# Altium project AnalExtend.PrjPcb
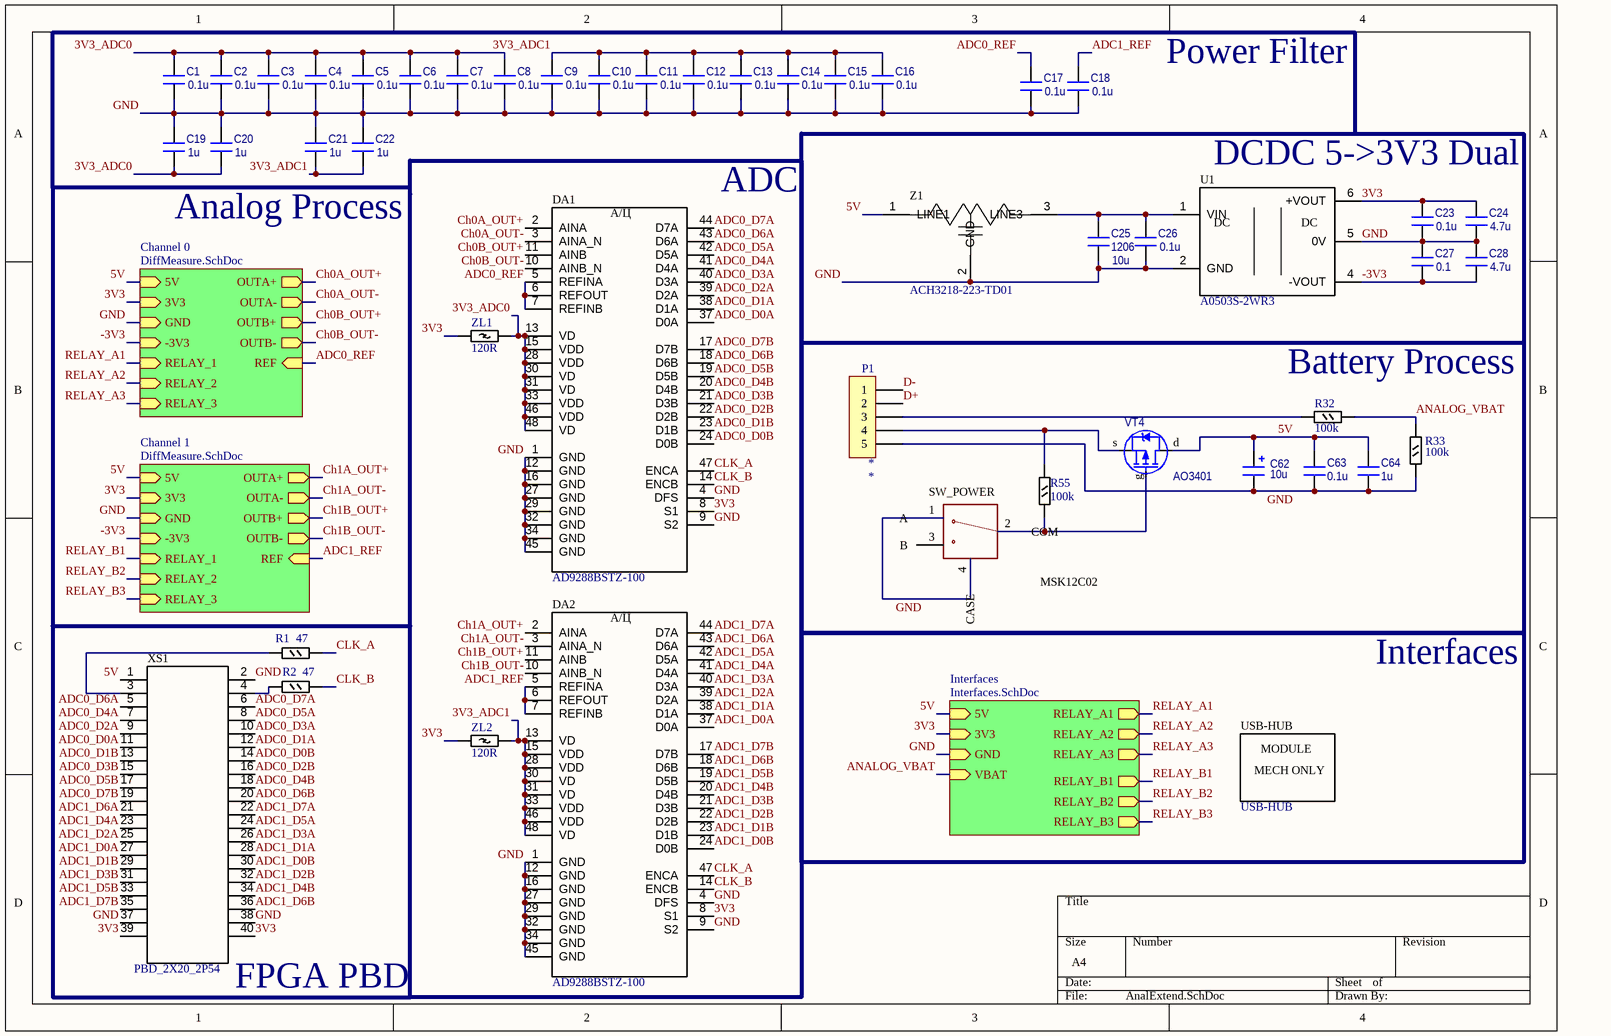
[diagram p0: AnalExtend.SchDoc]
3 sheets, 277 parts. Net scope: hierarchical (ports join the sheet entries above them; power ports are global).
Board file: AnalExtend.PcbDoc
Sheets:
  AnalExtend.SchDoc
    Channel 0 = DiffMeasure.SchDoc
    Channel 1 = DiffMeasure.SchDoc
    Interfaces = Interfaces.SchDoc

## Sheet AnalExtend.SchDoc
size A4

### Parts
C1  value 0.1u  [CAPC2012(0805)N]
C2  value 0.1u  [CAPC2012(0805)N]
C3  value 0.1u  [CAPC2012(0805)N]
C4  value 0.1u  [CAPC2012(0805)N]
C5  value 0.1u  [CAPC2012(0805)N]
C6  value 0.1u  [CAPC2012(0805)N]
C7  value 0.1u  [CAPC2012(0805)N]
C8  value 0.1u  [CAPC2012(0805)N]
C9  value 0.1u  [CAPC2012(0805)N]
C10  value 0.1u  [CAPC2012(0805)N]
C11  value 0.1u  [CAPC2012(0805)N]
C12  value 0.1u  [CAPC2012(0805)N]
C13  value 0.1u  [CAPC2012(0805)N]
C14  value 0.1u  [CAPC2012(0805)N]
C15  value 0.1u  [CAPC2012(0805)N]
C16  value 0.1u  [CAPC2012(0805)N]
C17  value 0.1u  [CAPC2012(0805)N]
C18  value 0.1u  [CAPC2012(0805)N]
C19  value 1u  [CAPC2012(0805)N]
C20  value 1u  [CAPC2012(0805)N]
C21  value 1u  [CAPC2012(0805)N]
C22  value 1u  [CAPC2012(0805)N]
C23  value 0.1u  [CAPC2012(0805)N]
C24  value 4.7u  [CAPC2012(0805)N]
C25  value 10u  Package: 1206  [CAP_CER_1206]  (hidden comment: 2700p 50V)
C26  value 0.1u  [CAPC2012(0805)N]
C27  value 0.1  [CAPC2012(0805)N]
C28  value 4.7u  [CAPC2012(0805)N]
C62  10u  [CAPMP3528X210N]
C63  0.1u  [CAPC2012(0805)N]
C64  1u  [CAPC2012(0805)N]
DA1  AD9288BSTZ-100  [AD9288BSTZ-100_LQFP48]
DA2  AD9288BSTZ-100  [AD9288BSTZ-100_LQFP48]
P1  P_HEADER_1x5  [P_HEADER_1x5_2.54_ANGLE]  (value not drawn)
R1  47  [RESC2012(0805)N]
R2  47  [RESC2012(0805)N]
R32  100k  [RESC2012(0805)N]
R33  100k  [RESC2012(0805)N]
R55  100k  [RESC2012(0805)N]
SW_POWER  MSK12C02  [MSK12C02]
U1  A0503S-2WR3  [A0503S-2WR3_SIP5]
USB-HUB  USB-HUB  [MINGWU_29P3X18P9_MECH]
VT4  AO3401  [SOT23-3N]
XS1  PBD_2X20_2P54  [PBD_2X20_2P54_THT]
Z1  ACH3218-223-TD01  [ACH3218_3TERM_FILTER]
ZL1  120R  [INDC1608(0603)N]
ZL2  120R  [INDC1608(0603)N]

### Blocks framed on the sheet
ADC: DA1 DA2 ZL1 ZL2

### Sub-sheets
Channel 0 = DiffMeasure.SchDoc: 3V3 (in), GND (in), REF (in), -3V3 (in), 5V (in), OUTA- (out), OUTB+ (out), OUTA+ (out), OUTB- (out), RELAY_1 (in), RELAY_2 (in), RELAY_3 (in)
Channel 1 = DiffMeasure.SchDoc: 3V3 (in), GND (in), REF (in), -3V3 (in), 5V (in), OUTA- (out), OUTB+ (out), OUTB- (out), OUTA+ (out), RELAY_2 (in), RELAY_3 (in), RELAY_1 (in)
Interfaces = Interfaces.SchDoc: 5V (in), 3V3 (in), GND (in), VBAT (in), RELAY_B3 (out), RELAY_B2 (out), RELAY_B1 (out), RELAY_A3 (out), RELAY_A2 (out), RELAY_A1 (out)

### Nets
3V3: C23.1 C24.1 DA1.8(S1) DA2.8(S1) U1.6(+VOUT) XS1.39 XS1.40 ZL1.1 ZL2.1 ; sheet Channel 0/3V3, sheet Channel 1/3V3, sheet Interfaces/3V3
3V3_ADC0: C1.1 C2.1 C3.1 C4.1 C5.1 C6.1 C7.1 C8.1 C19.2 C20.2 DA1.13(VD) DA1.15(VDD) DA1.28(VDD) DA1.30(VD) DA1.31(VD) DA1.33(VDD) DA1.46(VDD) DA1.48(VD) ZL1.2
3V3_ADC1: C9.1 C10.1 C11.1 C12.1 C13.1 C14.1 C15.1 C16.1 C21.2 C22.2 DA2.13(VD) DA2.15(VDD) DA2.28(VDD) DA2.30(VD) DA2.31(VD) DA2.33(VDD) DA2.46(VDD) DA2.48(VD) ZL2.2
5V: C62.1 C63.1 C64.1 VT4.d XS1.1 Z1.1(LINE1) ; sheet Channel 0/5V, sheet Channel 1/5V, sheet Interfaces/5V
-3V3: C27.2 C28.2 U1.4(-VOUT) ; sheet Channel 0/-3V3, sheet Channel 1/-3V3
ADC0_D0A: DA1.37(D0A) XS1.11
ADC0_D0B: DA1.24(D0B) XS1.14
ADC0_D1A: DA1.38(D1A) XS1.12
ADC0_D1B: DA1.23(D1B) XS1.13
ADC0_D2A: DA1.39(D2A) XS1.9
ADC0_D2B: DA1.22(D2B) XS1.16
ADC0_D3A: DA1.40(D3A) XS1.10
ADC0_D3B: DA1.21(D3B) XS1.15
ADC0_D4A: DA1.41(D4A) XS1.7
ADC0_D4B: DA1.20(D4B) XS1.18
ADC0_D5A: DA1.42(D5A) XS1.8
ADC0_D5B: DA1.19(D5B) XS1.17
ADC0_D6A: DA1.43(D6A) XS1.5
ADC0_D6B: DA1.18(D6B) XS1.20
ADC0_D7A: DA1.44(D7A) XS1.6
ADC0_D7B: DA1.17(D7B) XS1.19
ADC0_REF: C17.1 DA1.5(REFINA) DA1.6(REFOUT) DA1.7(REFINB) ; sheet Channel 0/REF
ADC1_D0A: DA2.37(D0A) XS1.27
ADC1_D0B: DA2.24(D0B) XS1.30
ADC1_D1A: DA2.38(D1A) XS1.28
ADC1_D1B: DA2.23(D1B) XS1.29
ADC1_D2A: DA2.39(D2A) XS1.25
ADC1_D2B: DA2.22(D2B) XS1.32
ADC1_D3A: DA2.40(D3A) XS1.26
ADC1_D3B: DA2.21(D3B) XS1.31
ADC1_D4A: DA2.41(D4A) XS1.23
ADC1_D4B: DA2.20(D4B) XS1.34
ADC1_D5A: DA2.42(D5A) XS1.24
ADC1_D5B: DA2.19(D5B) XS1.33
ADC1_D6A: DA2.43(D6A) XS1.21
ADC1_D6B: DA2.18(D6B) XS1.36
ADC1_D7A: DA2.44(D7A) XS1.22
ADC1_D7B: DA2.17(D7B) XS1.35
ADC1_REF: C18.1 DA2.5(REFINA) DA2.6(REFOUT) DA2.7(REFINB) ; sheet Channel 1/REF
ANALOG_VBAT: R32.2 R33.1 ; sheet Interfaces/VBAT
Ch0A_OUT+: DA1.2(AINA) ; sheet Channel 0/OUTA+
Ch0A_OUT-: DA1.3(AINA_N) ; sheet Channel 0/OUTA-
Ch0B_OUT+: DA1.11(AINB) ; sheet Channel 0/OUTB+
Ch0B_OUT-: DA1.10(AINB_N) ; sheet Channel 0/OUTB-
Ch1A_OUT+: DA2.2(AINA) ; sheet Channel 1/OUTA+
Ch1A_OUT-: DA2.3(AINA_N) ; sheet Channel 1/OUTA-
Ch1B_OUT+: DA2.11(AINB) ; sheet Channel 1/OUTB+
Ch1B_OUT-: DA2.10(AINB_N) ; sheet Channel 1/OUTB-
CLK_A: DA1.47(ENCA) DA2.47(ENCA) R1.2
CLK_B: DA1.14(ENCB) DA2.14(ENCB) R2.2
D+: P1.2
D-: P1.1
GND: C1.2 C2.2 C3.2 C4.2 C5.2 C6.2 C7.2 C8.2 C9.2 C10.2 C11.2 C12.2 C13.2 C14.2 C15.2 C16.2 C17.2 C18.2 C19.1 C20.1 C21.1 C22.1 C23.2 C24.2 C25.2 C26.2 C27.1 C28.1 C62.2 C63.2 C64.2 DA1.1(GND) DA1.4(DFS) DA1.9(S2) DA1.12(GND) DA1.16(GND) DA1.27(GND) DA1.29(GND) DA1.32(GND) DA1.34(GND) DA1.45(GND) DA2.1(GND) DA2.4(DFS) DA2.9(S2) DA2.12(GND) DA2.16(GND) DA2.27(GND) DA2.29(GND) DA2.32(GND) DA2.34(GND) DA2.45(GND) P1.5 R33.2 SW_POWER.1(A) SW_POWER.4(CASE) U1.2(GND) U1.5(0V) XS1.2 XS1.37 XS1.38 Z1.2(GND) ; sheet Channel 0/GND, sheet Channel 1/GND, sheet Interfaces/GND
RELAY_A1: sheet Channel 0/RELAY_1, sheet Interfaces/RELAY_A1
RELAY_A2: sheet Channel 0/RELAY_2, sheet Interfaces/RELAY_A2
RELAY_A3: sheet Channel 0/RELAY_3, sheet Interfaces/RELAY_A3
RELAY_B1: sheet Channel 1/RELAY_1, sheet Interfaces/RELAY_B1
RELAY_B2: sheet Channel 1/RELAY_2, sheet Interfaces/RELAY_B2
RELAY_B3: sheet Channel 1/RELAY_3, sheet Interfaces/RELAY_B3
NetC25_1: C25.1 C26.1 U1.1(VIN) Z1.3(LINE3)
NetP1_3: P1.3 R32.1
NetP1_4: P1.4 R55.2 VT4.s
NetR1_1: R1.1 XS1.3
NetR2_1: R2.1 XS1.4
NetR55_1: R55.1 SW_POWER.2(COM) VT4.g

Not connected (* = marked no-connect by the designer): SW_POWER 3(B)

### Notes on the sheet
- Power Filter
- DCDC 5->3V3 Dual
- Analog Process
- Battery Process
- Interfaces
- (near XS1) FPGA PBD
- (in symbol A0503S-2WR3) DC
- (in symbol AD9288BSTZ-100) А/Ц
- (in symbol MINGWU_29P3X18P9_MECH) MODULE; MECH ONLY

### Library data of the parts
C1-C24 C26-C28 C63 C64 = CAPC2012(0805): Voltage: *; Part Number: CAPC2012(0805)
  C1-C24 C26-C28: Package: 0805
  C63: Package: 0.1u; Value: *
  C64: Package: 1u; Value: *
C25 = 12065A272GAT2A: Cap Cer MLCC SMD 50V 2700p C0G NP0 1206 2%; Voltage: *; Part Number: 12065A272GAT2A; MPN: 12065A272GAT2A; Mouser Part Number: 581-12065A272G; HelpURL: https://eu.mouser.com/ProductDetail/AVX/12065A272GAT2A?qs=ZdaRgelF1GpUV998NMwU6A%3D%3D
C62 = TAJB105K035SNJ: Tantalum Capacitors - Solid SMD 35V 1uF 10%; MPN: 581-TAJB105K035S; Part Number: TAJB105K035SNJ; Mouser Part Number: TAJB105K035SNJ; HelpURL: https://eu.mouser.com/ProductDetail/KYOCERA-AVX/TAJB105K035SNJ?qs=sGAEpiMZZMtZ1n0r9vR22f0Jgorj1M1uNDk8%2FjXB31s%3D
DA1 DA2 = AD9288BSTZ-100: Analog Devices dual 8-bit ADC, 100 MSPS, LQFP-48 ST-48
P1 = P_HEADER_1x5: Pin Header; SCH_Footprint: *; Value: *
R1 R2 R32 R33 R55 = RESC2012(0805): Part Number: RESC2012(0805); Package: 0805
SW_POWER = MSK12C02: Shou Han MSK12C02 miniature SMD SPDT slide switch, ON-ON, 12 VDC 50 mA; four case tabs are pin 4; Manufacturer: SHOU HAN; Manufacturer Part Number: MSK12C02; LCSC Part Number: C431540
U1 = A0503S-2WR3: YLPTEC 2 W isolated DC/DC, 5 V input, +/-3.3 V dual output
USB-HUB = MINGWU_29P3X18P9_MECH: Mechanical-only Mingwudianzi module; no electrical pins
VT4 = PJA3433_R1_00001: MOSFET 30V P-Channel Enhancement Mode MOSFET-ESD Protected; pin to pad: d>3 g>1 s>2; Part Number: PJA3433_R1_00001; HelpURL: https://eu.mouser.com/ProductDetail/241-PJA3433_R1_00001; Digi-Key Part Number: 3757-PJA3433_R1_00001CT-ND; Manufacturer Part Number: PJA3433_R1_00001; Package: SOT-23-3
XS1 = PBD_2X20_2P54: PBD-40 vertical 2x20 2.54 mm female through-hole socket
Z1 = ACH3218-223-TD01: TDK 22 nF three-terminal T-type EMI filter, 20 V, 1.5 A
ZL1 ZL2 = Ferite1608(0603): ferite bead; Manufacturer Part Number: BLM15PX471SN1D; Part Number: Ferite1608(0603); Price$: 0.14; Package: 0402; HelpURL: https://eu.mouser.com/ProductDetail/Murata-Electronics/BLM15PX471SN1D?qs=%2Fha2pyFadugFXr5biOyskwIVnWnam4MScgU55pluOIVbLGfRcJswjw%3D%3D; Mouser Part Number: BLM15PX471SN1D

## Sheet DiffMeasure.SchDoc
size A4
Used 2 times, as channels Channel 0, Channel 1. Parts and nets are listed once, with the designators drawn on the sheet.
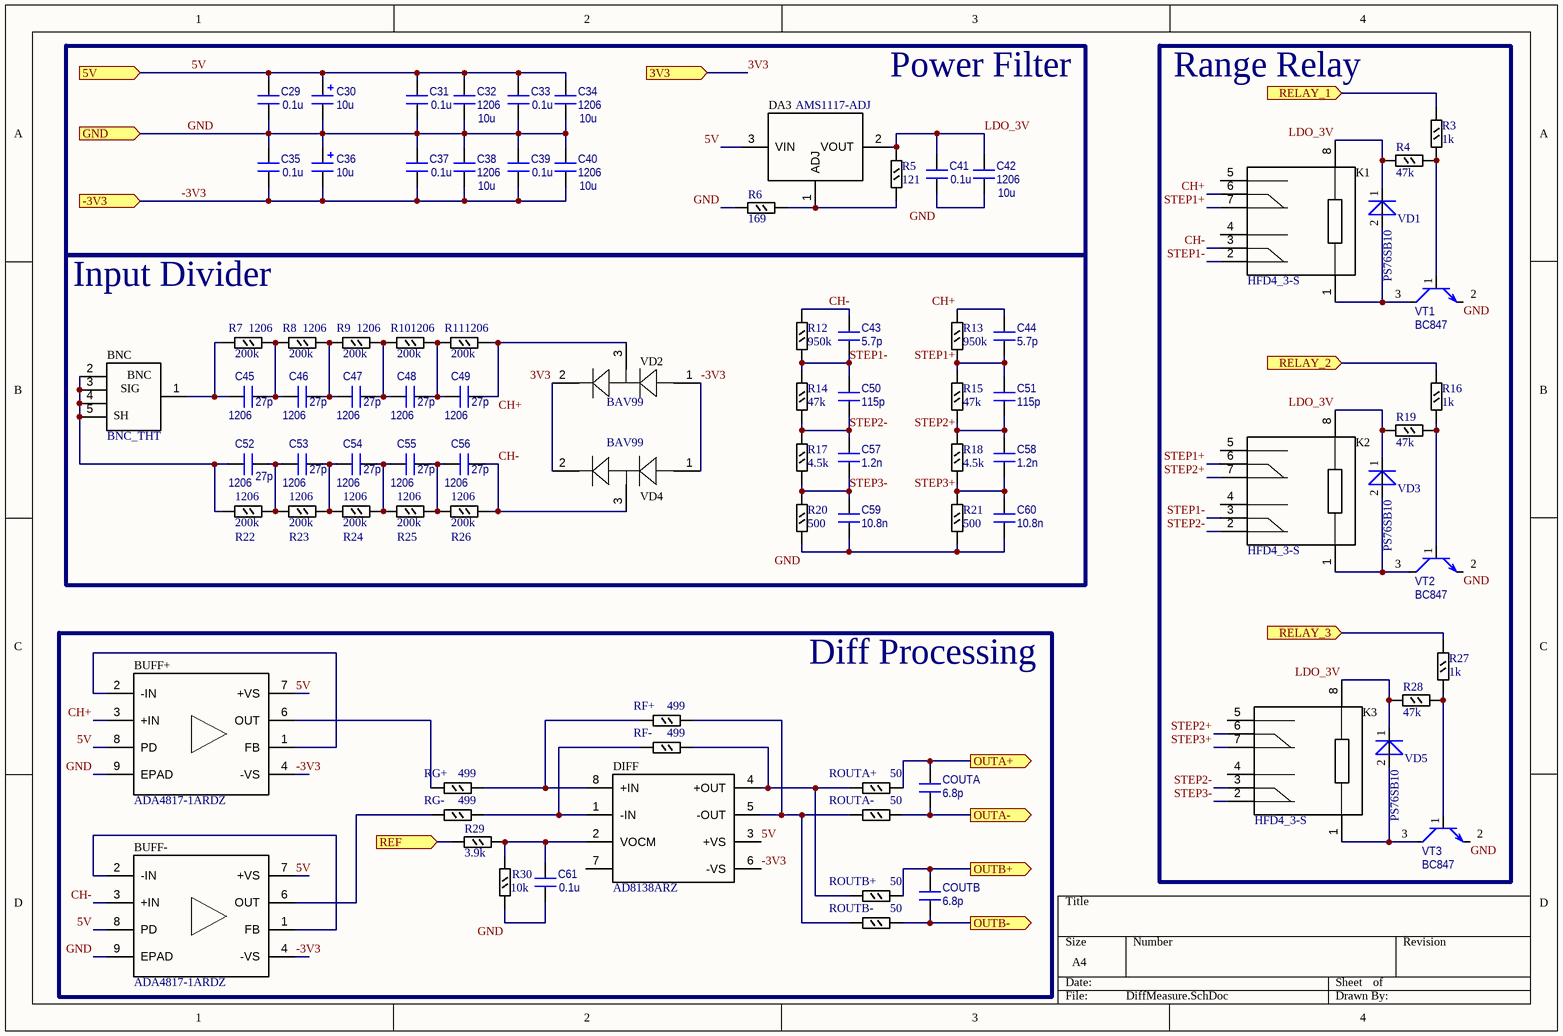
[diagram p1: DiffMeasure.SchDoc]

### Parts
BNC  BNC_THT  [BNC_VERTICAL_THT_5PIN]
BUFF+  ADA4817-1ARDZ  [ADA4817-1ARDZ_SOIC8_EP]
BUFF-  ADA4817-1ARDZ  [ADA4817-1ARDZ_SOIC8_EP]
C29  value 0.1u  [CAPC2012(0805)N]
C30  10u  [CAPMP7343X310N]
C31  value 0.1u  [CAPC2012(0805)N]
C32  value 10u  Package: 1206  [CAP_CER_1206]  (hidden comment: 2700p 50V)
C33  value 0.1u  [CAPC2012(0805)N]
C34  value 10u  Package: 1206  [CAP_CER_1206]  (hidden comment: 2700p 50V)
C35  value 0.1u  [CAPC2012(0805)N]
C36  10u  [CAPMP7343X310N]
C37  value 0.1u  [CAPC2012(0805)N]
C38  value 10u  Package: 1206  [CAP_CER_1206]  (hidden comment: 2700p 50V)
C39  value 0.1u  [CAPC2012(0805)N]
C40  value 10u  Package: 1206  [CAP_CER_1206]  (hidden comment: 2700p 50V)
C41  value 0.1u  [CAPC2012(0805)N]
C42  value 10u  Package: 1206  [CAP_CER_1206]  (hidden comment: 2700p 50V)
C43  value 5.7p  [CAPC2012(0805)N]
C44  value 5.7p  [CAPC2012(0805)N]
C45  value 27p  Package: 1206  [CAP_CER_1206]  (hidden comment: 2700p 50V)
C46  value 27p  Package: 1206  [CAP_CER_1206]  (hidden comment: 2700p 50V)
C47  value 27p  Package: 1206  [CAP_CER_1206]  (hidden comment: 2700p 50V)
C48  value 27p  Package: 1206  [CAP_CER_1206]  (hidden comment: 2700p 50V)
C49  value 27p  Package: 1206  [CAP_CER_1206]  (hidden comment: 2700p 50V)
C50  value 115p  [CAPC2012(0805)N]
C51  value 115p  [CAPC2012(0805)N]
C52  value 27p  Package: 1206  [CAP_CER_1206]  (hidden comment: 2700p 50V)
C53  value 27p  Package: 1206  [CAP_CER_1206]  (hidden comment: 2700p 50V)
C54  value 27p  Package: 1206  [CAP_CER_1206]  (hidden comment: 2700p 50V)
C55  value 27p  Package: 1206  [CAP_CER_1206]  (hidden comment: 2700p 50V)
C56  value 27p  Package: 1206  [CAP_CER_1206]  (hidden comment: 2700p 50V)
C57  value 1.2n  [CAPC2012(0805)N]
C58  value 1.2n  [CAPC2012(0805)N]
C59  value 10.8n  [CAPC2012(0805)N]
C60  value 10.8n  [CAPC2012(0805)N]
C61  value 0.1u  [CAPC2012(0805)N]
COUTA  value 6.8p  [CAPC2012(0805)N]
COUTB  value 6.8p  [CAPC2012(0805)N]
DA3  AMS1117-ADJ  [AMS1117-ADJ_SOT223]
DIFF  AD8138ARZ  [AD8138ARZ_SOIC8]
K1  HFD4_3-S  [HFD4_3_S_SMT]
K2  HFD4_3-S  [HFD4_3_S_SMT]
K3  HFD4_3-S  [HFD4_3_S_SMT]
R3  1k  [RESC2012(0805)N]
R4  47k  [RESC2012(0805)N]
R5  121  [RESC2012(0805)N]
R6  169  [RESC2012(0805)N]
R7  200k  Package: 1206  [R_1206]
R8  200k  Package: 1206  [R_1206]
R9  200k  Package: 1206  [R_1206]
R10  200k  Package: 1206  [R_1206]
R11  200k  Package: 1206  [R_1206]
R12  950k  [RESC2012(0805)N]
R13  950k  [RESC2012(0805)N]
R14  47k  [RESC2012(0805)N]
R15  47k  [RESC2012(0805)N]
R16  1k  [RESC2012(0805)N]
R17  4.5k  [RESC2012(0805)N]
R18  4.5k  [RESC2012(0805)N]
R19  47k  [RESC2012(0805)N]
R20  500  [RESC2012(0805)N]
R21  500  [RESC2012(0805)N]
R22  200k  Package: 1206  [R_1206]
R23  200k  Package: 1206  [R_1206]
R24  200k  Package: 1206  [R_1206]
R25  200k  Package: 1206  [R_1206]
R26  200k  Package: 1206  [R_1206]
R27  1k  [RESC2012(0805)N]
R28  47k  [RESC2012(0805)N]
R29  3.9k  [RESC2012(0805)N]
R30  10k  [RESC2012(0805)N]
RF+  499  [RESC2012(0805)N]
RF-  499  [RESC2012(0805)N]
RG+  499  [RESC2012(0805)N]
RG-  499  [RESC2012(0805)N]
ROUTA+  50  [RESC2012(0805)N]
ROUTA-  50  [RESC2012(0805)N]
ROUTB+  50  [RESC2012(0805)N]
ROUTB-  50  [RESC2012(0805)N]
VD1  PS76SB10  [SOD323]
VD2  BAV99  [BAV99_SOT23]
VD3  PS76SB10  [SOD323]
VD4  BAV99  [BAV99_SOT23]
VD5  PS76SB10  [SOD323]
VT1  BC847  [SOT23-3N]
VT2  BC847  [SOT23-3N]
VT3  BC847  [SOT23-3N]

### Blocks framed on the sheet
Power Filter: C29-C42 DA3 R5 R6
Range Relay: K1-K3 R3 R4 R16 R19 R27 R28 VD1 VD3 VD5 VT1-VT3
Input Divider: BNC C43-C60 R7-R15 R17 R18 R20-R26 VD2 VD4
Diff Processing: BUFF+ BUFF- C61 COUTA COUTB DIFF R29 R30 RF+ RF- RG+ RG- ROUTA+ ROUTA- ROUTB+ ROUTB-

### Ports
3V3 (in), 5V (in), -3V3 (in), GND (in), OUTA+ (out), OUTA- (out), OUTB+ (out), OUTB- (out), REF (in), RELAY_1 (in), RELAY_2 (in), RELAY_3 (in)

### Nets
3V3: VD2.2(K2) VD4.2(K2) ; port 3V3
5V: BUFF+.7(+VS) BUFF+.8(PD) BUFF-.7(+VS) BUFF-.8(PD) C29.1 C30.1 C31.1 C32.1 C33.1 C34.1 DA3.3(VIN) DIFF.3(+VS) ; port 5V
-3V3: BUFF+.4(-VS) BUFF-.4(-VS) C35.2 C36.2 C37.2 C38.2 C39.2 C40.2 DIFF.6(-VS) VD2.1(A1) VD4.1(A1) ; port -3V3
CH+: BUFF+.3(+IN) C44.1 C49.2 K1.6 R11.2 R13.2 VD2.3(K1_A2)
CH-: BUFF-.3(+IN) C43.1 C56.2 K1.3 R12.2 R26.2 VD4.3(K1_A2)
GND: BUFF+.9(EPAD) BUFF-.9(EPAD) C29.2 C30.2 C31.2 C32.2 C33.2 C34.2 C35.1 C36.1 C37.1 C38.1 C39.1 C40.1 C41.2 C42.2 C59.2 C60.2 C61.2 R6.1 R20.1 R21.1 R30.2 VT1.2(E) VT2.2(E) VT3.2(E) ; port GND
LDO_3V: C41.1 C42.1 DA3.2(VOUT) K1.8(COIL-) K2.8(COIL-) K3.8(COIL-) R4.2 R5.1 R19.2 R28.2 VD1.1(C) VD3.1(C) VD5.1(C)
OUTA+: COUTA.1 ROUTA+.2 ; port OUTA+
OUTA-: COUTA.2 ROUTA-.2 ; port OUTA-
OUTB+: COUTB.1 ROUTB+.2 ; port OUTB+
OUTB-: COUTB.2 ROUTB-.2 ; port OUTB-
REF: R29.1 ; port REF
RELAY_1: R3.1 ; port RELAY_1
RELAY_2: R16.1 ; port RELAY_2
RELAY_3: R27.1 ; port RELAY_3
STEP1+: C44.2 C51.1 K1.7 K2.6 R13.1 R15.2
STEP1-: C43.2 C50.1 K1.2 K2.3 R12.1 R14.2
STEP2+: C51.2 C58.1 K2.7 K3.6 R15.1 R18.2
STEP2-: C50.2 C57.1 K2.2 K3.3 R14.1 R17.2
STEP3+: C58.2 C60.1 K3.7 R18.1 R21.2
STEP3-: C57.2 C59.1 K3.2 R17.1 R20.2
NetBNC_1: BNC.1(SIGNAL) C45.1 R7.1
NetBNC_2: BNC.2(SHIELD) BNC.3(SHIELD) BNC.4(SHIELD) BNC.5(SHIELD) C52.1 R22.1
NetBUFF+_1: BUFF+.1(FB) BUFF+.2(-IN)
NetBUFF+_6: BUFF+.6(OUT) RG+.1
NetBUFF-_1: BUFF-.1(FB) BUFF-.2(-IN)
NetBUFF-_6: BUFF-.6(OUT) RG-.1
NetC45_2: C45.2 C46.1 R7.2 R8.1
NetC46_2: C46.2 C47.1 R8.2 R9.1
NetC47_2: C47.2 C48.1 R9.2 R10.1
NetC48_2: C48.2 C49.1 R10.2 R11.1
NetC52_2: C52.2 C53.1 R22.2 R23.1
NetC53_2: C53.2 C54.1 R23.2 R24.1
NetC54_2: C54.2 C55.1 R24.2 R25.1
NetC55_2: C55.2 C56.1 R25.2 R26.1
NetC61_1: C61.1 DIFF.2(VOCM) R29.2 R30.1
NetDA3_1: DA3.1(ADJ) R5.2 R6.2
NetDIFF_1: DIFF.1(-IN) RF-.1 RG-.2
NetDIFF_4: DIFF.4(+OUT) RF-.2 ROUTA+.1 ROUTB+.1
NetDIFF_5: DIFF.5(-OUT) RF+.2 ROUTA-.1 ROUTB-.1
NetDIFF_8: DIFF.8(+IN) RF+.1 RG+.2
NetK1_1: K1.1(COIL+) VD1.2(A) VT1.3(C)
NetK2_1: K2.1(COIL+) VD3.2(A) VT2.3(C)
NetK3_1: K3.1(COIL+) VD5.2(A) VT3.3(C)
NetR3_2: R3.2 R4.1 VT1.1(B)
NetR16_2: R16.2 R19.1 VT2.1(B)
NetR27_2: R27.2 R28.1 VT3.1(B)

Not connected (* = marked no-connect by the designer): DIFF 7; K1 4 5; K2 4 5; K3 4 5

### Channels
Channel 0: designators end in _Channel_0; ports 3V3=3V3 5V=5V -3V3=-3V3 GND=GND OUTA+=Ch0A_OUT+ OUTA-=Ch0A_OUT- OUTB+=Ch0B_OUT+ OUTB-=Ch0B_OUT- REF=ADC0_REF RELAY_1=RELAY_A1 RELAY_2=RELAY_A2 RELAY_3=RELAY_A3
Channel 1: designators end in _Channel_1; ports 3V3=3V3 5V=5V -3V3=-3V3 GND=GND OUTA+=Ch1A_OUT+ OUTA-=Ch1A_OUT- OUTB+=Ch1B_OUT+ OUTB-=Ch1B_OUT- REF=ADC1_REF RELAY_1=RELAY_B1 RELAY_2=RELAY_B2 RELAY_3=RELAY_B3

### Notes on the sheet
- (in symbol BNC_VERTICAL_THT) SIG; SH

### Library data of the parts
BNC = BNC_VERTICAL_THT: Generic vertical BNC jack, five through-hole terminals
BUFF+ BUFF- = ADA4817-1ARDZ: ADI ADA4817-1ARDZ FastFET op amp, RD-8-4 SOIC-8 with EP
C29 C31 C33 C35 C37 C39 C41 C43 C44 C50 C51 C57-C61 COUTA COUTB = CAPC2012(0805): Package: 0805; Voltage: *; Part Number: CAPC2012(0805)
C30 C36 = CapTantD: Part Number: CapTantD
C32 C34 C38 C40 C42 C45-C49 C52-C56 = 12065A272GAT2A: as C25 on sheet AnalExtend; Voltage: *; Part Number: 12065A272GAT2A; MPN: 12065A272GAT2A; Mouser Part Number: 581-12065A272G; HelpURL: https://eu.mouser.com/ProductDetail/AVX/12065A272GAT2A?qs=ZdaRgelF1GpUV998NMwU6A%3D%3D
DA3 = AMS1117-ADJ: AMS1117 adjustable voltage regulator, SOT-223; tab = VOUT
DIFF = AD8138ARZ: ADI AD8138ARZ low distortion differential ADC driver, SOIC-8 R-8
K1-K3 = HFD4_3-S: Hongfa HFD4/3-S monostable DPDT relay, standard SMT terminal
R3-R30 RF+ RF- RG+ RG- ROUTA+ ROUTA- ROUTB+ ROUTB- = RESC2012(0805): Part Number: RESC2012(0805)
  R3-R6 R12-R21 R27-R30 RF+ RF- RG+ RG- ROUTA+ ROUTA- ROUTB+ ROUTB-: Package: 0805
VD1 VD3 VD5 = BAT54J: Schottky Diode 30V 0,2A  SOD-323-2; Part Number: BAT54J; Manufacturer Part Number: BAT54J,115; Published: 8-Jun-2000; LatestRevisionDate: 17-Jul-2002; LatestRevisionNote: Re-released for DXP Platform.; DatasheetVersion: 1997; PackageReference: DO-35; Publisher: Altium Limited; PackageDescription: Diode, Axial; Body 3.8 x 1.9 mm (LxDia. max), Lead Dia. 0.53 mm (max); Code_JEDEC: DO-204-AH; ComponentLink1Description: Manufacturer Link; ComponentLink1URL: http://www.fairchildsemi.com/; ComponentLink2Description: Datasheet; ComponentLink2URL: http://www.fairchildsemi.com/ds/1N%2F1N4148.pdf; HelpURL: https://eu.mouser.com/ProductDetail/Nexperia/BAT54J115?qs=me8TqzrmIYVxNBNrx1zKWQ%3D%3D; Price$: 0.06; Mouser Part Number: 771-BAT54J115
VD2 VD4 = BAV99: Nexperia BAV99 dual series diode, SOT23
VT1-VT3 = BC848: Part Number: BC848; HelpURL: http://www.nxp.com/documents/data_sheet/BC848_SER.pdf

## Sheet Interfaces.SchDoc
size A4
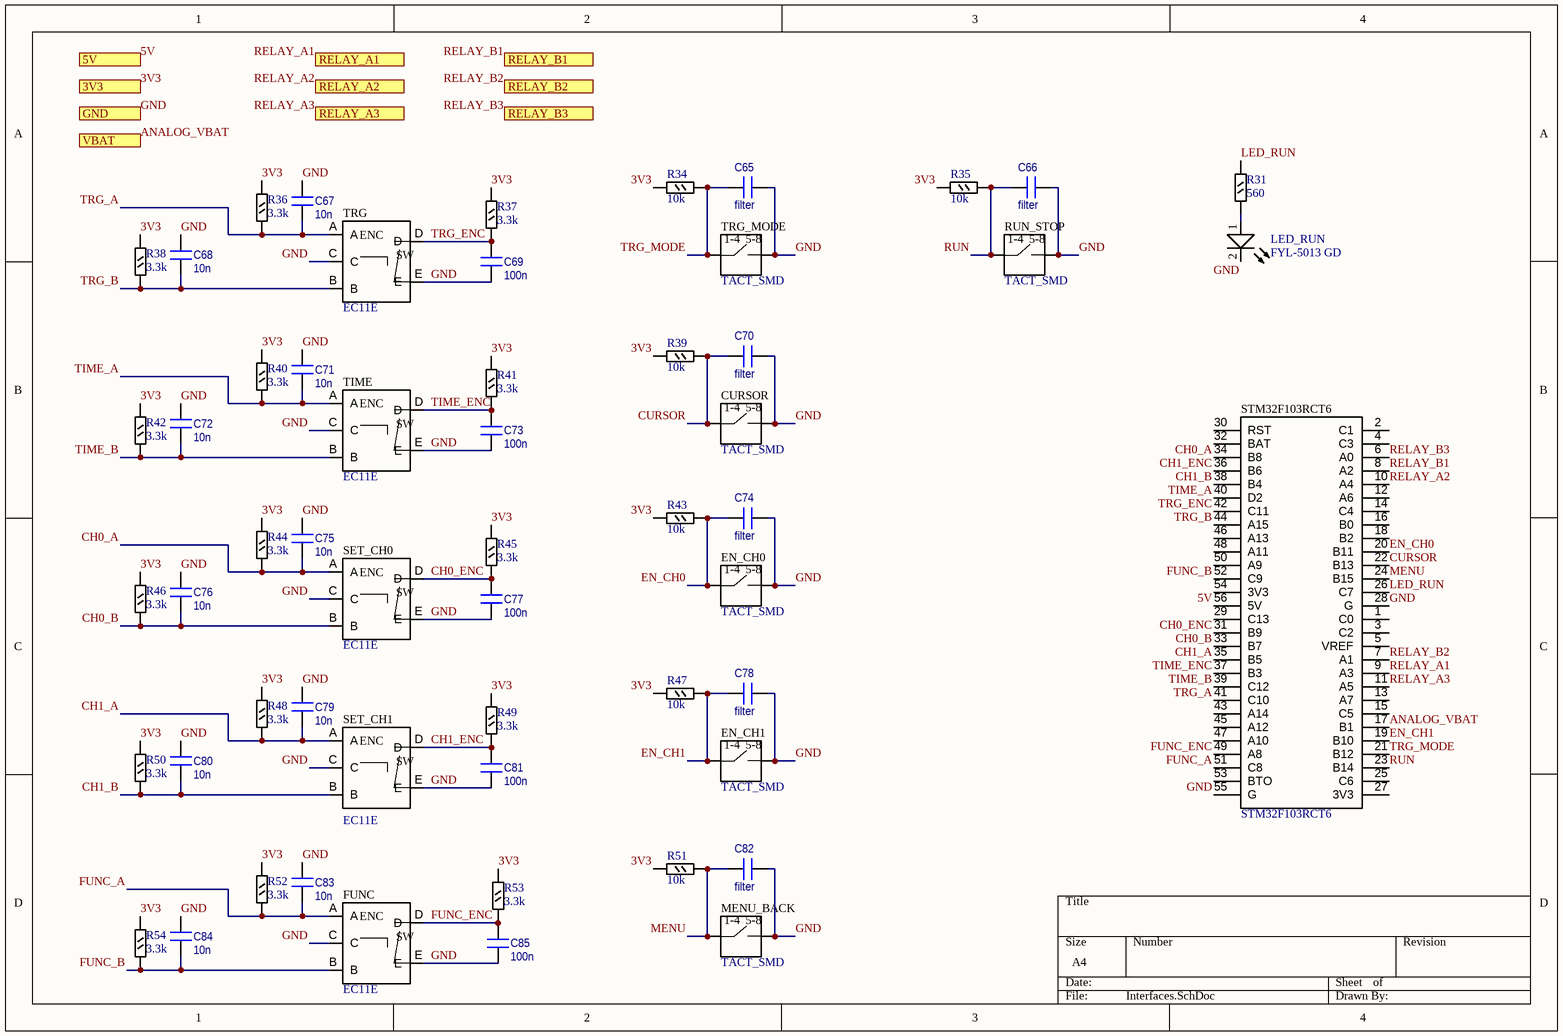
[diagram p2: Interfaces.SchDoc]

### Parts
C65  value filter  [CAPC2012(0805)N]
C66  value filter  [CAPC2012(0805)N]
C67  value 10n  [CAPC2012(0805)N]
C68  value 10n  [CAPC2012(0805)N]
C69  value 100n  [CAPC2012(0805)N]
C70  value filter  [CAPC2012(0805)N]
C71  value 10n  [CAPC2012(0805)N]
C72  value 10n  [CAPC2012(0805)N]
C73  value 100n  [CAPC2012(0805)N]
C74  value filter  [CAPC2012(0805)N]
C75  value 10n  [CAPC2012(0805)N]
C76  value 10n  [CAPC2012(0805)N]
C77  value 100n  [CAPC2012(0805)N]
C78  value filter  [CAPC2012(0805)N]
C79  value 10n  [CAPC2012(0805)N]
C80  value 10n  [CAPC2012(0805)N]
C81  value 100n  [CAPC2012(0805)N]
C82  value filter  [CAPC2012(0805)N]
C83  value 10n  [CAPC2012(0805)N]
C84  value 10n  [CAPC2012(0805)N]
C85  value 100n  [CAPC2012(0805)N]
CURSOR  TACT_SMD  [TACT_SMD_ON_DIP8_RAISED]
EN_CH0  TACT_SMD  [TACT_SMD_ON_DIP8_RAISED]
EN_CH1  TACT_SMD  [TACT_SMD_ON_DIP8_RAISED]
FUNC  EC11E  [EC11E_ENCODER_SW]
LED_RUN  FYL-5013 GD  [LED_3MM_GREEN]
MENU_BACK  TACT_SMD  [TACT_SMD_ON_DIP8_RAISED]
R31  560  [RESC2012(0805)N]
R34  10k  [RESC2012(0805)N]
R35  10k  [RESC2012(0805)N]
R36  3.3k  [RESC2012(0805)N]
R37  3.3k  [RESC2012(0805)N]
R38  3.3k  [RESC2012(0805)N]
R39  10k  [RESC2012(0805)N]
R40  3.3k  [RESC2012(0805)N]
R41  3.3k  [RESC2012(0805)N]
R42  3.3k  [RESC2012(0805)N]
R43  10k  [RESC2012(0805)N]
R44  3.3k  [RESC2012(0805)N]
R45  3.3k  [RESC2012(0805)N]
R46  3.3k  [RESC2012(0805)N]
R47  10k  [RESC2012(0805)N]
R48  3.3k  [RESC2012(0805)N]
R49  3.3k  [RESC2012(0805)N]
R50  3.3k  [RESC2012(0805)N]
R51  10k  [RESC2012(0805)N]
R52  3.3k  [RESC2012(0805)N]
R53  3.3k  [RESC2012(0805)N]
R54  3.3k  [RESC2012(0805)N]
RUN_STOP  TACT_SMD  [TACT_SMD_ON_DIP8_RAISED]
SET_CH0  EC11E  [EC11E_ENCODER_SW]
SET_CH1  EC11E  [EC11E_ENCODER_SW]
STM32F103RCT6  STM32F103RCT6  [STM32F103RCT6_MODULE_PBD_2X14]
TIME  EC11E  [EC11E_ENCODER_SW]
TRG  EC11E  [EC11E_ENCODER_SW]
TRG_MODE  TACT_SMD  [TACT_SMD_ON_DIP8_RAISED]

### Ports
3V3 (in), 5V (in), GND (in), RELAY_A1 (out), RELAY_A2 (out), RELAY_A3 (out), RELAY_B1 (out), RELAY_B2 (out), RELAY_B3 (out), VBAT (in)

### Nets
3V3: R34.2 R35.2 R36.2 R37.2 R38.2 R39.2 R40.2 R41.2 R42.2 R43.2 R44.2 R45.2 R46.2 R47.2 R48.2 R49.2 R50.2 R51.2 R52.2 R53.2 R54.2 ; port 3V3
5V: STM32F103RCT6.56(5V) ; port 5V
ANALOG_VBAT: STM32F103RCT6.17(B1) ; port VBAT
CH0_A: C75.1 R44.1 SET_CH0.A STM32F103RCT6.34(B8)
CH0_B: C76.1 R46.1 SET_CH0.B STM32F103RCT6.33(B7)
CH0_ENC: C77.2 R45.1 SET_CH0.D STM32F103RCT6.31(B9)
CH1_A: C79.1 R48.1 SET_CH1.A STM32F103RCT6.35(B5)
CH1_B: C80.1 R50.1 SET_CH1.B STM32F103RCT6.38(B4)
CH1_ENC: C81.2 R49.1 SET_CH1.D STM32F103RCT6.36(B6)
CURSOR: C70.1 CURSOR.1(A) CURSOR.2(A) CURSOR.3(A) CURSOR.4(A) R39.1 STM32F103RCT6.22(B13)
EN_CH0: C74.1 EN_CH0.1(A) EN_CH0.2(A) EN_CH0.3(A) EN_CH0.4(A) R43.1 STM32F103RCT6.20(B11)
EN_CH1: C78.1 EN_CH1.1(A) EN_CH1.2(A) EN_CH1.3(A) EN_CH1.4(A) R47.1 STM32F103RCT6.19(B10)
FUNC_A: C83.1 FUNC.A R52.1 STM32F103RCT6.51(C8)
FUNC_B: C84.1 FUNC.B R54.1 STM32F103RCT6.52(C9)
FUNC_ENC: C85.2 FUNC.D R53.1 STM32F103RCT6.49(A8)
GND: C65.2 C66.2 C67.2 C68.2 C69.1 C70.2 C71.2 C72.2 C73.1 C74.2 C75.2 C76.2 C77.1 C78.2 C79.2 C80.2 C81.1 C82.2 C83.2 C84.2 C85.1 CURSOR.5(B) CURSOR.6(B) CURSOR.7(B) CURSOR.8(B) EN_CH0.5(B) EN_CH0.6(B) EN_CH0.7(B) EN_CH0.8(B) EN_CH1.5(B) EN_CH1.6(B) EN_CH1.7(B) EN_CH1.8(B) FUNC.C FUNC.E LED_RUN.2(K) MENU_BACK.5(B) MENU_BACK.6(B) MENU_BACK.7(B) MENU_BACK.8(B) RUN_STOP.5(B) RUN_STOP.6(B) RUN_STOP.7(B) RUN_STOP.8(B) SET_CH0.C SET_CH0.E SET_CH1.C SET_CH1.E STM32F103RCT6.28(G) STM32F103RCT6.55(G) TIME.C TIME.E TRG.C TRG.E TRG_MODE.5(B) TRG_MODE.6(B) TRG_MODE.7(B) TRG_MODE.8(B) ; port GND
LED_RUN: R31.2 STM32F103RCT6.26(C7)
MENU: C82.1 MENU_BACK.1(A) MENU_BACK.2(A) MENU_BACK.3(A) MENU_BACK.4(A) R51.1 STM32F103RCT6.24(B15)
RELAY_A1: STM32F103RCT6.9(A3) ; port RELAY_A1
RELAY_A2: STM32F103RCT6.10(A4) ; port RELAY_A2
RELAY_A3: STM32F103RCT6.11(A5) ; port RELAY_A3
RELAY_B1: STM32F103RCT6.8(A2) ; port RELAY_B1
RELAY_B2: STM32F103RCT6.7(A1) ; port RELAY_B2
RELAY_B3: STM32F103RCT6.6(A0) ; port RELAY_B3
RUN: C66.1 R35.1 RUN_STOP.1(A) RUN_STOP.2(A) RUN_STOP.3(A) RUN_STOP.4(A) STM32F103RCT6.23(B14)
TIME_A: C71.1 R40.1 STM32F103RCT6.40(D2) TIME.A
TIME_B: C72.1 R42.1 STM32F103RCT6.39(C12) TIME.B
TIME_ENC: C73.2 R41.1 STM32F103RCT6.37(B3) TIME.D
TRG_A: C67.1 R36.1 STM32F103RCT6.41(C10) TRG.A
TRG_B: C68.1 R38.1 STM32F103RCT6.44(A15) TRG.B
TRG_ENC: C69.2 R37.1 STM32F103RCT6.42(C11) TRG.D
TRG_MODE: C65.1 R34.1 STM32F103RCT6.21(B12) TRG_MODE.1(A) TRG_MODE.2(A) TRG_MODE.3(A) TRG_MODE.4(A)
NetLED_RUN_1: LED_RUN.1(A) R31.1

Not connected (* = marked no-connect by the designer): STM32F103RCT6 1(C0) 2(C1) 3(C2) 4(C3) 5(VREF) 12(A6) 13(A7) 14(C4) 15(C5) 16(B0) 18(B2) 25(C6) 27(3V3) 29(C13) 30(RST) 32(BAT) 43(A14) 45(A12) 46(A13) 47(A10) 48(A11) 50(A9) 53(BTO) 54(3V3)

### Notes on the sheet
- (in symbol EC11E_ENCODER_SW) ENC; SW
- (in symbol TACT_SMD_ON_DIP8_RAISED) 1-4; 5-8

### Library data of the parts
C65-C85 = CAPC2012(0805): Package: 0805; Voltage: *; Part Number: CAPC2012(0805)
CURSOR EN_CH0 EN_CH1 MENU_BACK RUN_STOP TRG_MODE = TACT_SMD_ON_DIP8_RAISED: Custom raised NO tactile switch; pins 1-4 common, pins 5-8 common
FUNC SET_CH0 SET_CH1 TIME TRG = EC11E_ENCODER_SW: Alps Alpine EC11E vertical incremental encoder with one push-on switch
R31 R34-R54 = RESC2012(0805): Part Number: RESC2012(0805); Package: 0805
STM32F103RCT6 = STM32F103RCT6_MODULE_PBD_2X14: STM32F103RCT6 core board, 56 pins, two PBD 2x14 sockets
LED_RUN = FYL-5013 GD: Part Number: FYL-5013 GD

## Nets that join several sheets
3V3: AnalExtend (9 pins), Channel 0 (VD2_Channel_0.2 VD4_Channel_0.2), Channel 1 (VD2_Channel_1.2 VD4_Channel_1.2), Interfaces (21 pins)
5V: AnalExtend (6 pins), Channel 0 (12 pins), Channel 1 (12 pins), Interfaces (STM32F103RCT6.56)
-3V3: AnalExtend (C27.2 C28.2 U1.4), Channel 0 (11 pins), Channel 1 (11 pins)
ADC0_REF: AnalExtend (C17.1 DA1.5 DA1.6 DA1.7), Channel 0 (R29_Channel_0.1)
ADC1_REF: AnalExtend (C18.1 DA2.5 DA2.6 DA2.7), Channel 1 (R29_Channel_1.1)
ANALOG_VBAT: AnalExtend (R32.2 R33.1), Interfaces (STM32F103RCT6.17)
Ch0A_OUT+: AnalExtend (DA1.2), Channel 0 (COUTA_Channel_0.1 ROUTA+_Channel_0.2)
Ch0A_OUT-: AnalExtend (DA1.3), Channel 0 (COUTA_Channel_0.2 ROUTA-_Channel_0.2)
Ch0B_OUT+: AnalExtend (DA1.11), Channel 0 (COUTB_Channel_0.1 ROUTB+_Channel_0.2)
Ch0B_OUT-: AnalExtend (DA1.10), Channel 0 (COUTB_Channel_0.2 ROUTB-_Channel_0.2)
Ch1A_OUT+: AnalExtend (DA2.2), Channel 1 (COUTA_Channel_1.1 ROUTA+_Channel_1.2)
Ch1A_OUT-: AnalExtend (DA2.3), Channel 1 (COUTA_Channel_1.2 ROUTA-_Channel_1.2)
Ch1B_OUT+: AnalExtend (DA2.11), Channel 1 (COUTB_Channel_1.1 ROUTB+_Channel_1.2)
Ch1B_OUT-: AnalExtend (DA2.10), Channel 1 (COUTB_Channel_1.2 ROUTB-_Channel_1.2)
GND: AnalExtend (61 pins), Channel 0 (26 pins), Channel 1 (26 pins), Interfaces (58 pins)
RELAY_A1: Channel 0 (R3_Channel_0.1), Interfaces (STM32F103RCT6.9)
RELAY_A2: Channel 0 (R16_Channel_0.1), Interfaces (STM32F103RCT6.10)
RELAY_A3: Channel 0 (R27_Channel_0.1), Interfaces (STM32F103RCT6.11)
RELAY_B1: Channel 1 (R3_Channel_1.1), Interfaces (STM32F103RCT6.8)
RELAY_B2: Channel 1 (R16_Channel_1.1), Interfaces (STM32F103RCT6.7)
RELAY_B3: Channel 1 (R27_Channel_1.1), Interfaces (STM32F103RCT6.6)